# EasyEDA Pro project ProPrj_4s2p 18650 holder_2025-11-21.epro

# Schematic Schematic1
Board Name: Board1; Create Date: 2025-08-13; Page Name: P1; Project Name: 4s2p 18650 holder; Schematic Name: Schematic1; Update Date: 2025-08-13; Company: EasyEDA.com; Page Size: A4; Version: V1.0
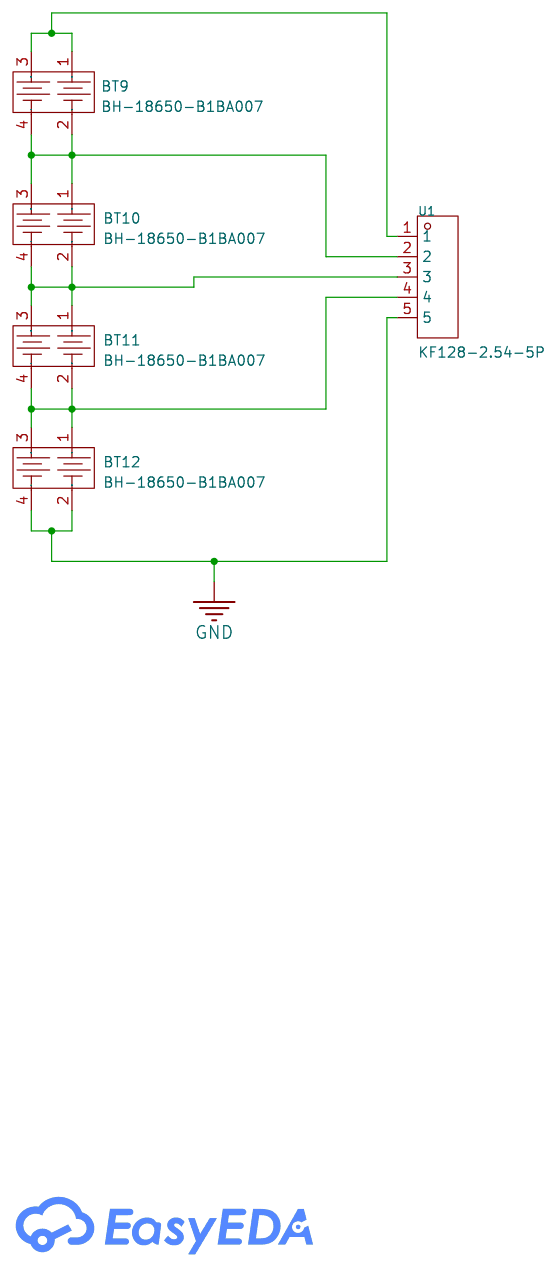
[diagram p0: schematic sheet]

## Parts
BT9  BH-18650-B1BA007  [BAT-SMD_BH-18650-B1BA007]
BT10  BH-18650-B1BA007  [BAT-SMD_BH-18650-B1BA007]
BT11  BH-18650-B1BA007  [BAT-SMD_BH-18650-B1BA007]
BT12  BH-18650-B1BA007  [BAT-SMD_BH-18650-B1BA007]
U1  KF128-2.54-5P  [CONN-TH_5P-P2.54_KF128-2.54-5P]

## Library data of the parts
BT9-BT12 = BH-18650-B1BA007: Connector Type:Battery box Battery Type:- Contact Material:Phosphor Bronze Contact Plating:Gold Operating Temperature Range:-25℃~+85℃ Operating Temperature Range:-25℃~+85℃; LCSC Part Name: 电池盒; Supplier Part: C6937126; Manufacturer: MYOUNG(美阳); Supplier Footprint: SMD; JLCPCB Part Class: Extended Part; Datasheet: https://atta.szlcsc.com/upload/public/pdf/source/20230625/4623181BB33816751543B6366072761C.pdf; Supplier: LCSC; Connector Type: Battery box; Contact Material: Phosphor Bronze; Contact Plating: Gold; Operating Temperature Range: -25℃~+85℃
U1 = KF128-2.54-5P: Structure:1x5P Pitch:2.54mm Color:Green Mounting Style:Straight Current Rating (Max):8A Voltage Rating (Max):130V Number of Pins:5P Number of Rows:1 Wire Gauge - AWG:18~26 Wire Gauge - AWG:18~26 Wire Gauge - mm2:1 Wire Gauge - mm2:1 Number of PINs Per Row; LCSC Part Name: 2.54mm 1x5P 排数:1 每排P数:5 直插; Supplier Part: C474923; Manufacturer: KEFA(科发); Supplier Footprint: 插件,P=2.54mm; JLCPCB Part Class: Extended Part; Datasheet: https://atta.szlcsc.com/upload/public/pdf/source/20230317/0E5ECA9DB49110BC3219D12632CEA6EE.pdf; Supplier: LCSC; Structure: 1x5P; Pitch: 2.54mm; Color: Green; Mounting Style: Straight; Current Rating (Max): 8A; Voltage Rating (Max): 130V; Number of Pins: 5P; Number of Rows: 1; Wire Gauge - AWG: 18~26; Wire Gauge - mm2: 1; Number of PINs Per Row: 5; Operating Temperature Range: -40℃~+105℃

## Nets
GND: BT12.2 BT12.4 U1.5
$1N276: BT11.2 BT11.4 BT12.1 BT12.3 U1.4
$1N285: BT10.2 BT10.4 BT11.1 BT11.3 U1.3
$1N294: BT9.2 BT9.4 BT10.1 BT10.3 U1.2
$1N303: BT9.1 BT9.3 U1.1

# Board PCB1
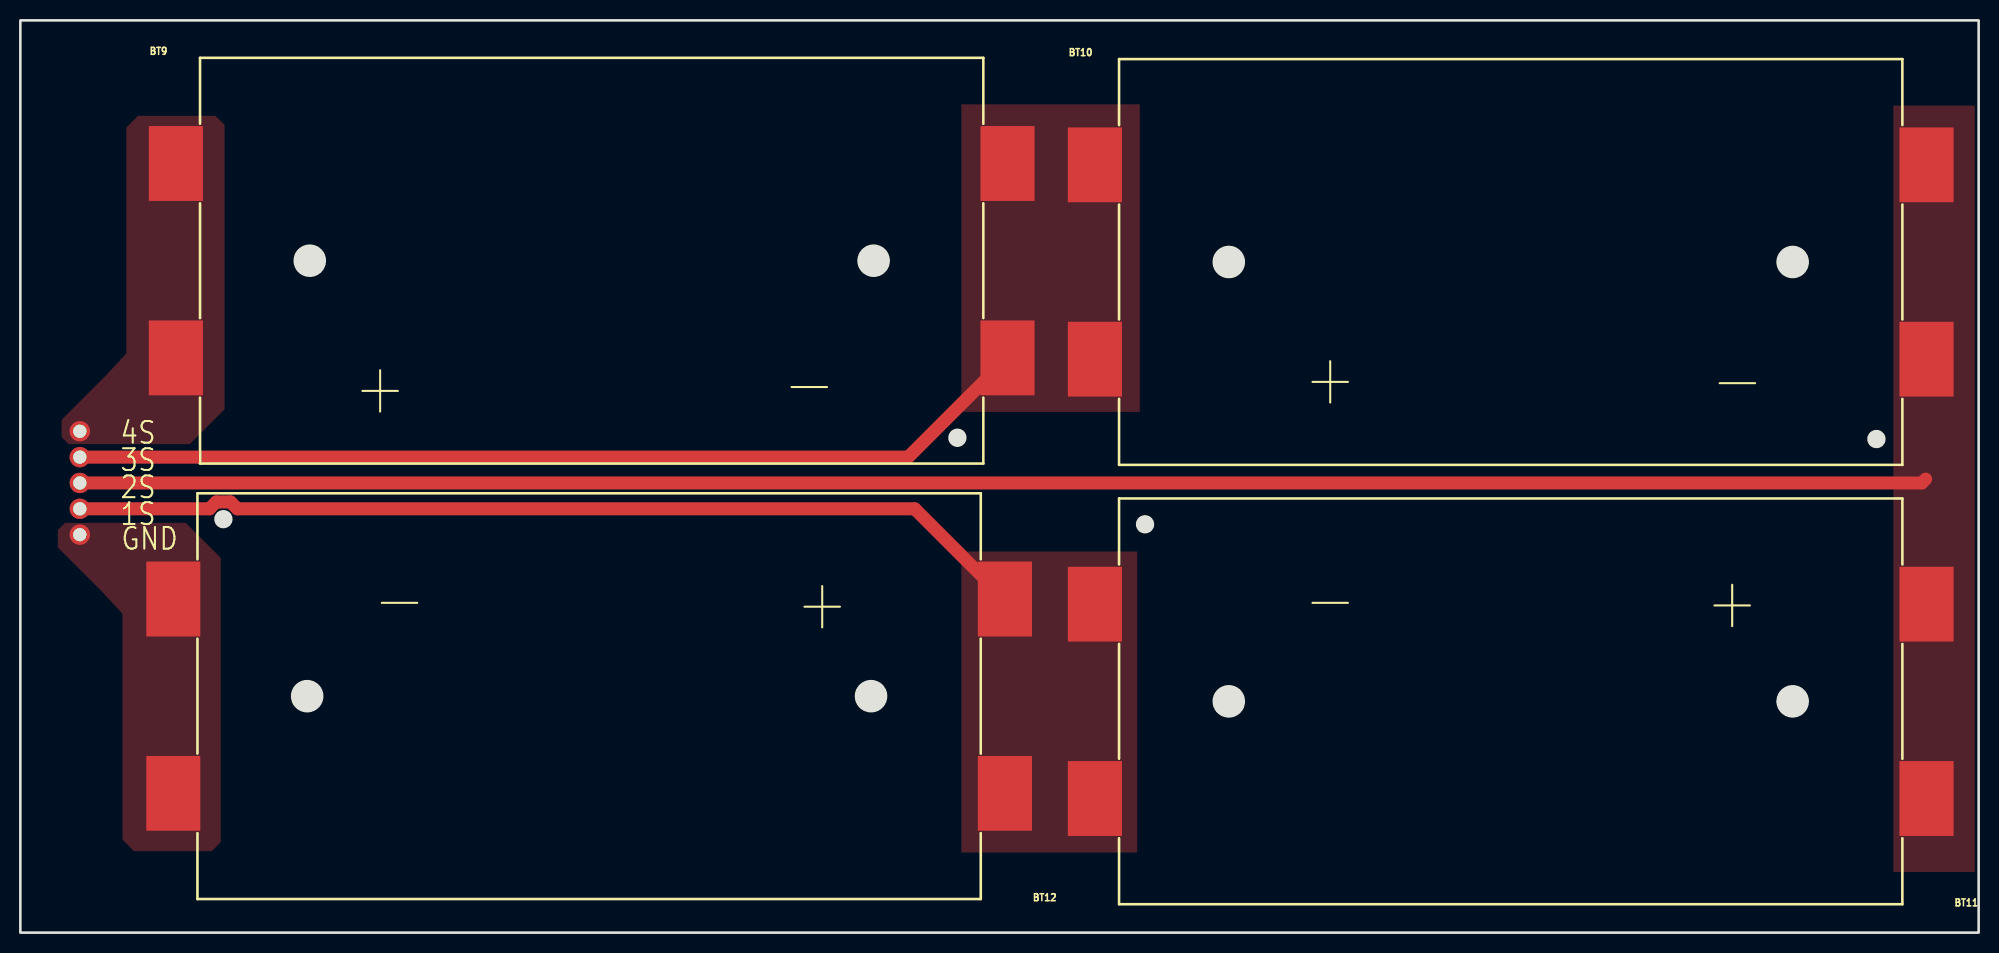
[diagram p1: board, top side]
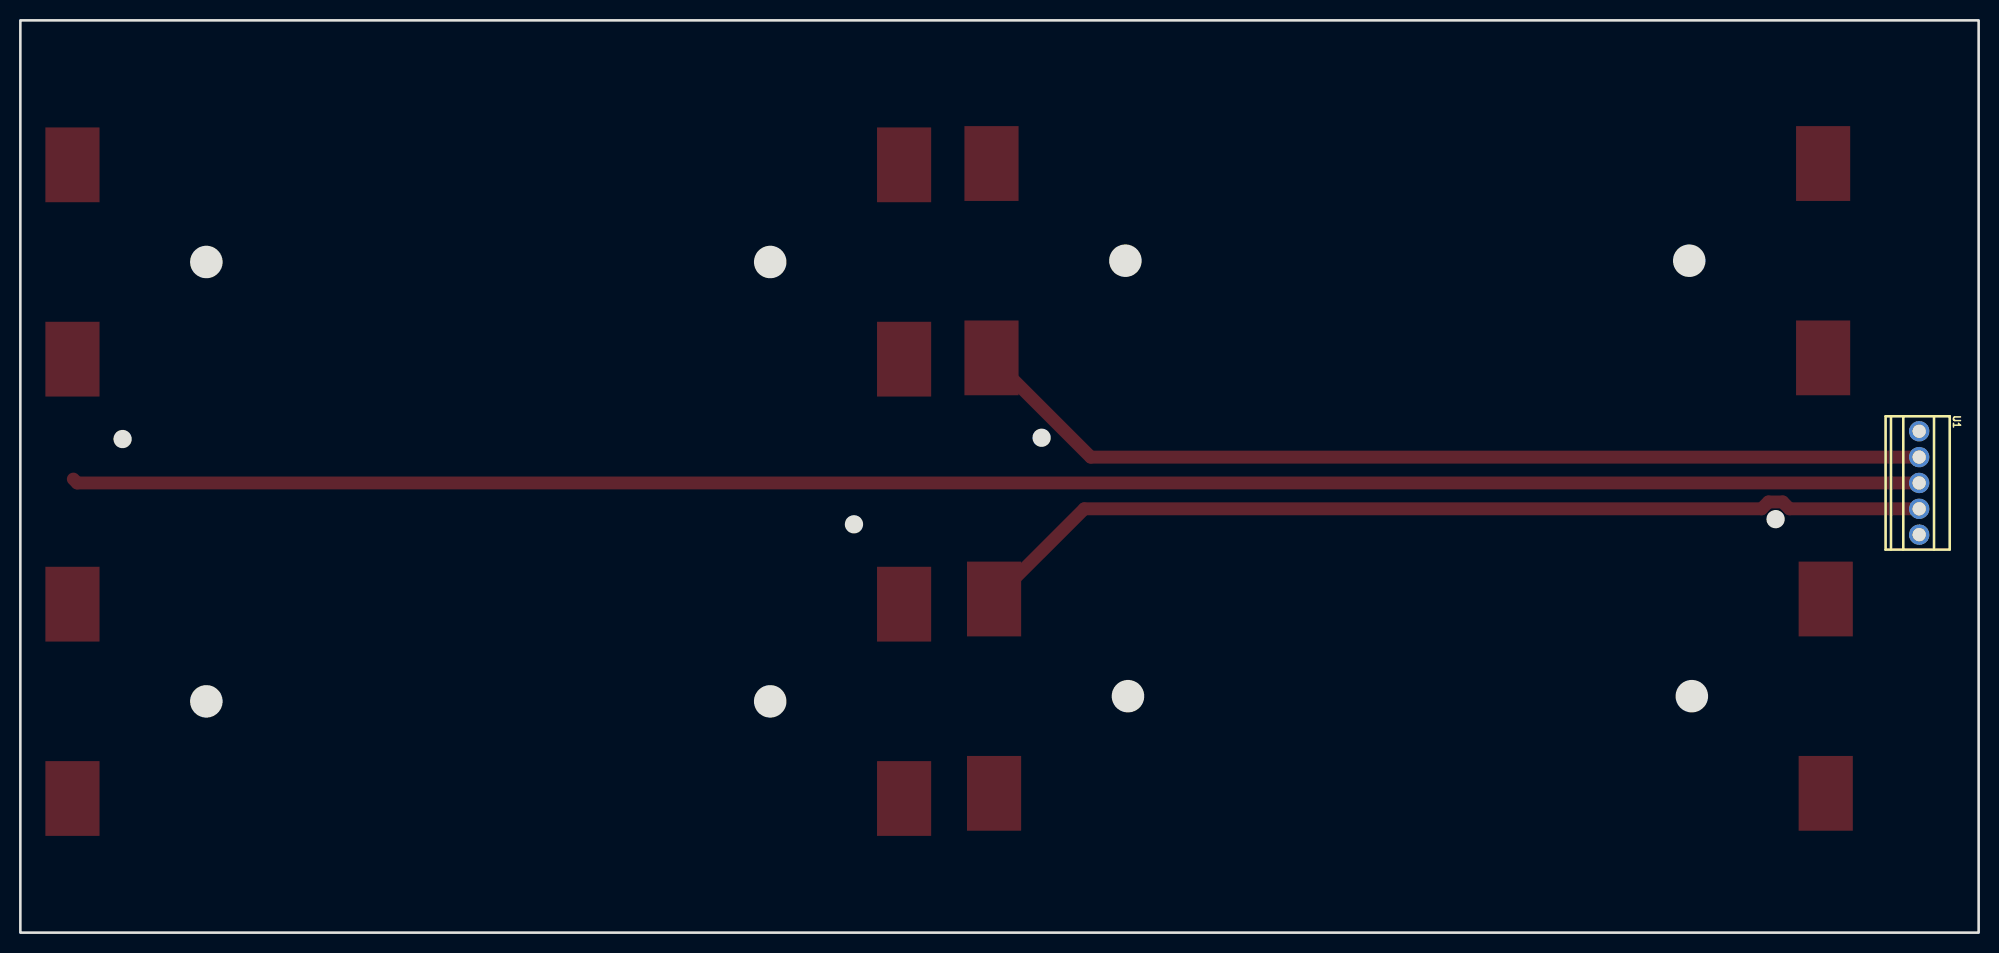
[diagram p2: board, bottom side, seen from below]

Outline 192.41 x 89.66 mm; copper layers: Top Layer, Inner1, Inner2, Inner3, Inner4, Inner5, Inner6, Inner7, Inner8, Inner9, Inner10, Inner11, Inner12, Inner13, Inner14, Inner15, Inner16, Inner17, Inner18, Inner19, Inner20, Inner21, Inner22, Inner23, Inner24, Inner25, Inner26, Inner27, Inner28, Inner29, Inner30, Bottom Layer. Coordinates in mm from the lower left corner of the outline.
Outline path: rectangle 0,89.66 192.41,0
Stack: Top Layer 0.035mm / Dielectric1 1.51mm FR4 er 4.5 / Bottom Layer 0.035mm

## Design rules (mm)
template: JLCPCB Capability(Two Layers Board)
spacing copperThickness1oz (default): track to track 0.102, other pairs 0.152 to 0.3
spacing copperThickness2oz: track to track 0.203, other pairs 0.152 to 0.3
track width copperThickness1oz (default): min 0.127, default 0.254, max 2.54
track width copperThickness2oz: min 0.203, default 0.254, max 2.54
differential pair differentialPair (default): width min 0.127, default 0.254, max 2.54; gap min 0.152, default 0.152
via viaSize (default): diameter min 0.5, default 0.61, max 10; hole min 0.3, default 0.305, max 6.3

## Placement (name value [footprint] x y rotation side)
BT9  BH-18650-B1BA007  [BAT-SMD_BH-18650-B1BA007]  56.13 66.04 0 top
BT10  BH-18650-B1BA007  [BAT-SMD_BH-18650-B1BA007]  146.43 65.91 0 top
BT11  BH-18650-B1BA007  [BAT-SMD_BH-18650-B1BA007]  146.43 22.73 180 top
BT12  BH-18650-B1BA007  [BAT-SMD_BH-18650-B1BA007]  55.88 23.24 180 top
U1  KF128-2.54-5P  [CONN-TH_5P-P2.54_KF128-2.54-5P]  5.84 44.2 270 bottom

## Footprints (pads in the part's own frame, mm; a bottom-side part is the same pattern mirrored in y, then rotated)
BAT-SMD_BH-18650-B1BA007
  rect 5.32x7.35 smd: 1(-40.855,9.55) 2(40.855,9.55) 3(-40.855,-9.55) 4(40.855,-9.55)
CONN-TH_5P-P2.54_KF128-2.54-5P
  round 2 hole 1.3: 1(-5.08,0) 2(-2.54,0) 3(0,0) 4(2.54,0) 5(5.08,0)

## Nets
As in the schematic.

## Routing (per net, layer and track width the routed paths; a pad name or vN(x,y) marks a point on that pad's centre or on a via; arc(x,y) is an arc through that point)
$1N276: length 95.1
  Top Layer w1.27: BT12.3 87.87,41.66 21.32,41.66 20.65,42.33 19.25,42.33 18.58,41.66 U1.4
$1N285: length 181.5
  Top Layer w1.27: U1.3 186.82,44.2 187.2,44.58
$1N294: length 95.2
  Top Layer w1.27: BT9.4 87.23,46.74 U1.2

## Copper pours and planes (outline as drawn; the poured copper is in the pictures)
GND on Top Layer: 3.68,40.28 19.69,40.28 19.69,8 3.68,8
$1N276 on Top Layer: 92.46,37.47 109.73,37.47 109.73,7.87 92.46,7.87
$1N285 on Top Layer: 184.02,81.28 192.02,81.28 192.02,5.97 184.02,5.97
$1N294 on Top Layer: 92.46,81.41 109.98,81.41 109.98,51.18 92.46,51.18
$1N303 on Top Layer: 4.06,80.27 20.07,80.27 20.07,48 4.06,48

## Text on the board
Top Silkscreen Layer: 4S | 3S | 2S | 1S | GND | + | -
